# Altium schematic sheet BoardA-PowerSupplies.SchDoc
size A; SheetNumber: 2; SheetTotal: 3
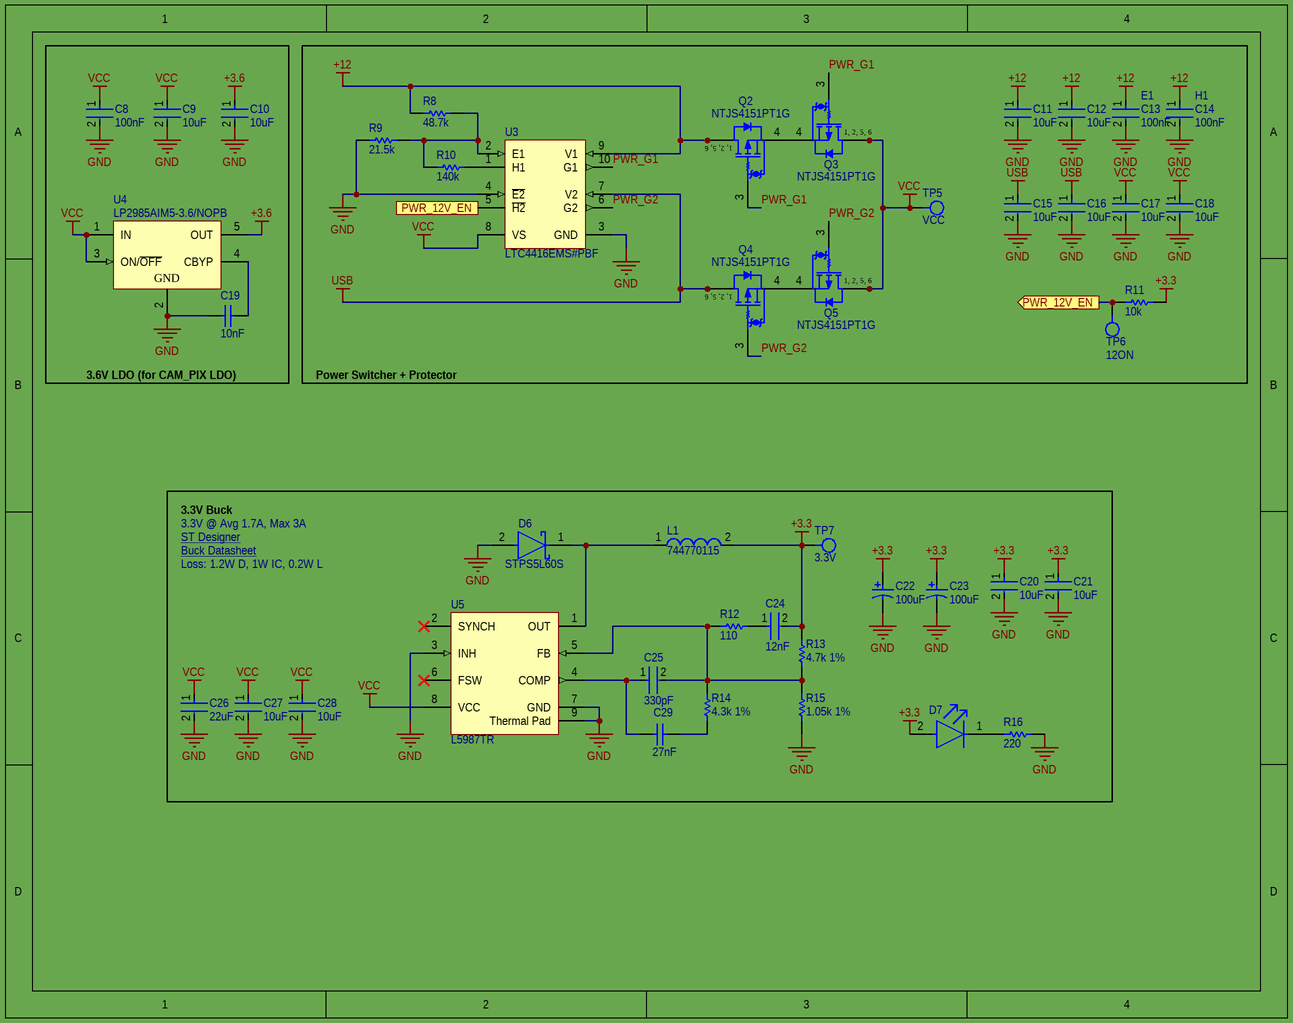
[diagram p0: BoardA-PowerSupplies.SchDoc]

## Parts
C8  100nF  [FP-CGA3E-0_3-0_1-IPC_A]
C9  10uF  [FP-C3225-250-0_4-MFG]
C10  10uF  [FP-C3225-250-0_4-MFG]
C11  10uF  [FP-C3225-250-0_4-MFG]
C12  10uF  [FP-C3225-250-0_4-MFG]
C13  100nF  [FP-CGA3E-0_3-0_1-IPC_A]
C14  100nF  [FP-CGA3E-0_3-0_1-IPC_A]
C15  10uF  [FP-C3225-250-0_4-MFG]
C16  10uF  [FP-C3225-250-0_4-MFG]
C17  10uF  [FP-C3225-250-0_4-MFG]
C18  10uF  [FP-C3225-250-0_4-MFG]
C19  10nF  [CAPC1608X90X35ML10T15]
C20  10uF  [FP-C3225-250-0_4-MFG]
C21  10uF  [FP-C3225-250-0_4-MFG]
C22  100uF  [CAPMP6032X28-T_V]
C23  100uF  [CAPMP6032X28-T_V]
C24  12nF  [FP-C0603C-CF-MFG]
C25  330pF  [FP-CC0603-DA-MFG]
C26  22uF  [FP-C4532-250-0_4-IPC_B]
C27  10uF  [FP-C3225-250-0_4-MFG]
C28  10uF  [FP-C3225-250-0_4-MFG]
C29  27nF  [CAPC1608X90X35NL10T15]
D6  STPS5L60S  [FP-STPS5L60S-MFG]
D7  SML-D12U1WT86  [FP-SML-D12-MFG]  (value not drawn)
L1  744770115  [WE-PD-XL]
Q2  NTJS4151PT1G  [ONSC-SC70-6-419B-02_W_V]
Q3  NTJS4151PT1G  [ONSC-SC70-6-419B-02_W_V]
Q4  NTJS4151PT1G  [ONSC-SC70-6-419B-02_W_V]
Q5  NTJS4151PT1G  [ONSC-SC70-6-419B-02_W_V]
R8  48.7k  [RESC1608X55X30ML15T15]
R9  21.5k  [RESC1608X55X30ML15T15]
R10  140k  [RESC1608X55X30LL15T15]
R11  10k  [RESC1609X55X30LL15T15]
R12  110  [RESC1608X55X30ML20T20]
R13  4.7k 1%  [RESC1608X55X30NL15T15]
R14  4.3k 1%  [RESC1609X50X30ML10T20]
R15  1.05k 1%  [RESC1608X55X30ML15T15]
R16  220  [RESC1005X40X25LL05T05]
TP5  VCC  [TestPoint1mm]
TP6  12ON  [TestPoint1mm]
TP7  3.3V  [TestPoint1mm]
U3  LTC4416EMS#PBF  [LT-MS-10_N]
U4  LP2985AIM5-3.6/NOPB  [MF05A_M]
U5  L5987TR  [VFQFPN8_M]

## Blocks framed on the sheet
3.6V LDO (for CAM_PIX LDO): C8-C10 C19 U4

## Ports
PWR_12V_EN (out)

## Nets
+3.3: C20.1 C21.1 C22.1 C23.1 C24.2 D7.2(A) L1.2 R11.2 R13.2 TP7.1
+3.6: C10.1 U4.5(OUT)
+12: C11.1 C12.1 C13.1 C14.1 Q2.1(D) Q2.2(D) Q2.5(D) Q2.6(D) R8.1 U3.9(V1)
GND: C8.2 C9.2 C10.2 C11.2 C12.2 C13.2 C14.2 C15.2 C16.2 C17.2 C18.2 C19.2 C20.2 C21.2 C22.2 C23.2 C26.2 C27.2 C28.2 D6.2(A) R9.1 R15.1 R16.2 U3.3(GND) U3.4(~{E2}) U4.2(GND) U5.3(INH) U5.7(GND) U5.9(Thermal_Pad)
USB: C15.1 C16.1 Q4.1(D) Q4.2(D) Q4.5(D) Q4.6(D) U3.7(V2)
VCC: C8.1 C9.1 C17.1 C18.1 C26.1 C27.1 C28.1 Q3.1(D) Q3.2(D) Q3.5(D) Q3.6(D) Q5.1(D) Q5.2(D) Q5.5(D) Q5.6(D) TP5.1 U3.8(VS) U4.1(IN) U4.3(ON/~{OFF}) U5.8(VCC)
PWR_12V_EN: R11.1 TP6.1 U3.5(~{H2}) ; port PWR_12V_EN
PWR_G1: Q2.3(G) Q3.3(G) U3.10(G1)
PWR_G2: Q4.3(G) Q5.3(G) U3.6(G2)
NetC19_1: C19.1 U4.4(CBYP)
NetC24_1: C24.1 R12.2
NetC25_1: C25.1 C29.2 U5.4(COMP)
NetC25_2: C25.2 R12.1 R13.1 R14.2 R15.2 U5.5(FB)
NetC29_1: C29.1 R14.1
NetD6_1: D6.1(C) L1.1 U5.1(OUT)
NetD7_1: D7.1(C) R16.1
NetQ2_4: Q2.4(S) Q3.4(S)
NetQ4_4: Q4.4(S) Q5.4(S)
NetR8_2: R8.2 R9.2 R10.1 U3.2(E1)
NetR10_2: R10.2 U3.1(H1)

Not connected (* = marked no-connect by the designer): U5 2(SYNCH)* 6(FSW)*

## Notes on the sheet
- E1
- (near C14) H1
- Power Switcher + Protector
- 3.3V Buck
- 3.3V @ Avg 1.7A, Max 3A
- ST Designer <https://eds.st.com/dcdc/>
- Buck Datasheet <https://www.mouser.com/datasheet/2/389/cd00208518-1796746.pdf>
- Loss: 1.2W D, 1W IC, 0.2W L
- (in symbol CMP-1058-00631-1) 1, 2, 5, 6

## Library data of the parts
C8 C13 C14 = CMP-2000-07546-2: Cap Ceramic 100nF 50V X7R 10% Pad SMD 0603 +125°C Automotive T/R; Weight: 7.1E-05oz; Composition: Ceramic; Max Operating Temperature: 125°C; Termination: SMD/SMT; Dielectric: X7R; Length: 1.6mm; Package Quantity: 1; REACH SVHC: No SVHC; Lead Free: Lead Free; Case Code (Metric): 1608; Min Operating Temperature: -55°C; Packaging: Tape and Reel; Tolerance: 10%; Voltage Rating: 50V; Case Code (Imperial): 0603; Capacitance: 100nF; Case/Package: 0603; Voltage Rating (DC): 50V; Depth: 0.8mm; Radiation Hardening: No; Ratings: AEC-Q200; Mount: Surface Mount; Voltage: 50V; Thickness: 0.035inch; Width: 0.8mm; Height: 0.8mm
C9-C12 C15-C18 C20 C21 C27 C28 = CMP-08246-002653-1: Multilayer Ceramic Capacitors 10uF ±20% 50V X7R SMD 1210; Width: 0.098inch; Package Quantity: 1000; Height: 2.5mm; Dielectric Material: Ceramic; Voltage Rating: 50V; Series: C; Capacitance: 10uF; Tolerance: 20%; Weight: 0.000564oz; Case/Package: 1210; Case Code (Imperial): 1210; Dielectric: X7R; Case Code (Metric): 3225; REACH SVHC: No SVHC; Packaging: Tape and Reel; Length: 0.126inch; Termination: SMD/SMT; Min Operating Temperature: -55°C; Voltage Rating (DC): 50V; Lead Free: Lead Free; Max Operating Temperature: 125°C; Thickness: 0.11inch; Mount: Surface Mount
C19 = CMP-2100-03642-1: Chip Capacitor, 10 nF, +/- 10%, 50 V, -55 to 125 degC, 0603 (1608 Metric), RoHS, Tape and Reel; Manufacturer: Murata; Insulation Resistance: 10GR; Dielectric: X7R; Voltage Rating: 50V; Material: Ceramic; Package Quantity: 1; Lead Free: LeadFree; Case/Package: 0603; Termination: SMD/SMT; REACH SVHC: Unknown; Manufacturer URL: http://www.murata.com/; Datasheet URL: http://search.murata.co.jp/Ceramy/image/img/A01X/G101/ENG/GRM188R71H103KA01-01.pdf; Mount: SurfaceMount; Datasheet Version: 42401.0; Number of Pins: 2; Length: 1.6mm; Voltage: 50V; Depth: 0.8mm; Tolerance: 10%; Min Operating Temperature: -55degC; Voltage Rating (DC): 50V; Max Operating Temperature: 125degC; Package Description: 2-Pin Surface Mount Device, Body 1.6 x 0.8 mm; RoHSCompliant: True; Case Code (Imperial): 0603; Width: 0.031inch; Case Code (Metric): 1608; Height: 0.8mm; Package Reference: 0603; Packaging: TapeandReel; Thickness: 0.035inch; Capacitance: 10nF; Dielectric Material: Ceramic
C22 C23 = CMP-2000-07294-1: Low ESR, 100 uF, 10 V, +/- 10%, -55 to 125 degC, 2-Pin SMD, RoHS, Tape and Reel; Manufacturer: AVX; DELETED: Compliant; Voltage: 10VDC; Rad Hardened: No; Polarity: Polar; Wire Form: NotRequired; Case Style: Molded; Product Length (mm): 6mm; DF: 8%; ESR: 0.1ohm; Product Diameter (mm): NotRequiredmm; Product Height (mm): 2.6mm; DCL: 10uA; Capacitance: 100000000pF; Product Depth (mm): 3.2mm; Tolerance (+ or -): 10%; Mounting Technology: SurfaceMount; Failure Rate: NotRequired; Mounting Style: SurfaceMount; Packaging: TapeandReel; Construction: SMTChip; Datasheet Version: 01/2017; Manufacturer URL: http://www.avx.com/; Case Code: C; Datasheet URL: http://datasheets.avx.com/TPS.pdf; Operating Temp Range: -55Cto125C; Package Description: 2-Pin Surface Mount Device, Body 6 x 3.25 mm; Seated Plane Height: NotRequiredmm; Length W/Weld (max): NotRequiredmm; Package URL: http://www.avx.com/download/software/literature/AVX-Footprint-Library.pdf; Package Reference: CAPMP06032X28-T; Length W/Weld: NotRequiredmm; Insulation: NotRequired; Lead Spacing (nom): NotRequiredmm; Package / Case: 6032-28; Seal: NotRequired
C24 = CMP-2006-02245-2: CAP CER 0.012UF 50V 10% X7R 0603; Manufacturer: KEMET; Manufacturer Part Number: C0603C123K5RACTU; Value: 12,000 pF; Automotive Grade: Grade 1; Material: Ceramic; Tolerance: 0.1; Temperature Coefficient: 30ppm/°C; Category: Cap; Height: 0.87mm; Lead Free: Yes; Temperature: -55°C to +125°C; Device Class L2: Capacitors; RoHS: TRUE; Capacitance: 12,000 pF; Mouser Description: Multilayer Ceramic Capacitors MLCC - SMD/SMT 50volts 12000pF X7R 10%; Temperature Range Low: -55°C; Temperature Range High: +125°C; Temperature Characteristic: X7R; Device Class L1: Passive Components; Package: C0603C-CF; Voltage Rating: 50 V; Octopart: https://octopart.com/c0603c123k5ractu-kemet-9143719; Device Class L3: Ceramic Capacitors; ComponentLink2URL: https://api.kemet.com/component-edge/download/datasheet/C0603C100J5GACAUTO.pdf; Automotive: Yes; ComponentLink2Description: Datasheet; Digikey Description: CAP CER 0.012UF 50V 10% X7R 0603
C25 = CMP-03422-000084-1: CAP CER 330PF 50V X7R 0603; Manufacturer Part Number: CC0603KRX7R9BB331; Manufacturer: YAGEO; Tolerance: 0.1; Temperature Coefficient: 15%; Material: Ceramic; Voltage Rating: 50 V; Temperature Characteristic: X7R; RoHS: TRUE; Height: 0.9mm; Voltage: 50 V; Package: CC0603-DA; Category: Cap; Automotive: No; Temperature Range Low: -55°C; Lead Free: Yes; Device Class L2: Capacitors; Device Class L1: Passive Components; ComponentLink2Description: Datasheet; Value: 330 pF; Capacitance: 330 pF; Temperature: -55°C to +125°C; Temperature Range High: +125°C; Mouser Description: CAP CER 330PF 50V X7R 0603; Octopart: https://octopart.com/cc0603krx7r9bb331-yageo-193039; Footprint Url: http://www.yageo.com/exep/pages/download/literatures/UPY-C_GEN_24.pdf; ComponentLink2URL: http://www.yageo.com/documents/recent/UPY-GPHC_X7R_6.3V-to-50V_18.pdf; Digikey Description: CAP CER 330PF 50V X7R 0603; Device Class L3: Ceramic Capacitors
C26 = CMP-08246-004073-1: Multilayer Ceramic Capacitors 22uF ±20% 25V X5R SMD 1812; Weight: 0.000952oz; RoHS Compliant: Yes; Construction: Flat; Max Operating Temperature: 85°C; Case Code (Metric): 4532; REACH SVHC: No SVHC; Tolerance: 20%; Number of Pins: 2; Package Quantity: 1; Mount: Surface Mount; Min Operating Temperature: -55°C; Voltage Rating (DC): 25V; Radiation Hardening: No; Capacitance: 22uF; Width: 0.126inch; Case/Package: 1812; Dielectric: X5R; Voltage Rating: 25V; Height: 2.5mm; Length: 4.5mm; Lead Free: Lead Free; Thickness: 0.11inch; Depth: 3.2mm; Voltage: 25V; Dielectric Material: Ceramic; Termination: SMD/SMT; Packaging: Tape and Reel; Case Code (Imperial): 1812; Resistor Type: Ceramic; Series: C
C29 = CMP-2006-02878-1: Part Number: GRM188R71E273KA01D; Manufacturer: Murata
D6 = CMP-12187-000009-2: DIODE SCHOTTKY 60V 5A SMC; Max Forward Surge Current (Ifsm): 150A; Max Reverse Leakage Current: 220uA; Forward Voltage: 520mV; Element Configuration: Single; Radiation Hardening: No; Package Quantity: 2500; REACH SVHC: No SVHC; Max Reverse Voltage (DC): 60V; Number of Pins: 2; Mount: Surface Mount; Height: 2.45mm; Forward Current: 5A; Packaging: Tape and Reel; Width: 6.25mm; Series: -; Peak Non-Repetitive Surge Current: 150A; Average Rectified Current: 5A; Max Surge Current: 150A; Case/Package: SMC; Lead Free: Lead Free; Max Repetitive Reverse Voltage (Vrrm): 60V; Min Operating Temperature: -65°C; RoHS Compliant: Yes; Length: 7.15mm; Max Reverse Current: 220uA; Max Operating Temperature: 150°C
D7 = CMP-08952-000009-1: LED RED DIFFUSED 1608 SMD; Manufacturer: Rohm; Led Orientation: Top View; Power Dissipation: 54mW; Forward Current: 20mA; Wavelength: 620nm; Reverse Voltage: 5V; Luminous Intensity: 63mcd; Forward Voltage: 2.2V; Mouser Description: SML-D12 Series Red 0603 Diffused 63 mcd 2.2 V Surface Mount LED; Temperature: -40°C to +85°C; Device Class L2: LEDs; Lead Free: Yes; Automotive: No; Octopart: https://octopart.com/sml-d12u1wt86-rohm-70850259; RoHS: TRUE; Colour: Red; Digikey Description: LED RED DIFFUSED 1608 SMD; Package: SML-D12; Device Class L1: Optoelectronics; Category: Diode; Temperature Range High: +85°C; Height: 0.65mm; ComponentLink2Description: Datasheet; Temperature Range Low: -40°C; ComponentLink2URL: https://www.rohm.com/datasheet/SML-D12U1W/sml-d12x1-e; Manufacturer Part Number: SML-D12U1WT86; Device Class L3: unset
L1 = CMP-0227-00202-1: SMD-Shielded Power Inductor WE-PD, L = 15.0 µH; Inductance: 15.0 ÂµH; PackageDescription: SMD Inductor, 2-Leads, Body 12.0 x 12.0 mm; ComponentLink2Description: Datasheet; PackageReference: WE-PD-XL; ComponentLink1URL: http://www.we-online.com; ComponentLink1Description: Manufacturer Link; DatasheetVersion: ver 5, Oct-2004; PackageVersion: 2004; ComponentLink2URL: http://www.we-online.de/katalog/media/pdf/744770115.pdf
Q2-Q5 = CMP-1058-00631-1: Trench Power MOSFET, -20 V, -4.2 A, Single P-Channel, 6-Pin SC70, Pb-Free, Tape and Reel; Manufacturer: On Semiconductor; VGS(th) Max (V): 1.2; VGS Max (V): 12; Crss Typ (pF): 110; Ciss Typ (pF): 850; PD Max (W): 1; Qrr Typ (nC): 0.23; ID Max (A): 4.2; Coss Typ (pF): 160; Channel Polarity: P Channel; V(BR)DSS Min (V): 20; Mounting Technology: Surface Mount; ComponentLink3Description: Package Specification; Packing: Tape and Reel; DatasheetVersion: Rev. 1; RoHS: Pb-Free; Configuration: Single; PackageReference: SC70-6-419B-02_W; PackageVersion: Rev. W; Package Type: SC-88-6 / SC-70-6 / SOT-363-6; ComponentLink3URL: http://www.onsemi.com/pub_link/Collateral/SMF05C-D.PDF; PackageDescription: 6-Pin Small Outline Transistor, Body 2 x 1.25 mm, Pitch 0.65 mm; PartNumber: NTJS4151PT1G; ComponentLink2Description: Datasheet; ComponentLink1Description: Manufacturer URL; ComponentLink2URL: http://www.onsemi.com/pub_link/Collateral/NTJS4151P-D.PDF; ComponentLink1URL: http://www.onsemi.com/
R8 = CMP-1012-00701-2: Manufacturer: Panasonic; Part Number: ERJ-3EKF4872V
R9 = CMP-2000-00332-1: Part Number: ERJ-3EKF2152V; Manufacturer: Panasonic
R10 = CMP-2000-00248-1: Manufacturer: Panasonic; Part Number: ERJ-3EKF1403V
R11 = CMP-1012-00623-3: Chip Resistor, 10 KOhm, +/- 1%, 0.1 W, -55 to 155 degC, 0603 (1608 Metric), RoHS, Tape and Reel; Manufacturer: Panasonic; Voltage Rating: 75V; Case\/Package: 0603; Power Rating: 100mW; Resistance: 10KOhm; Temperature Coefficient: 100ppm\/degreesC; Number of Pins: 2; Package Reference: 603; Depth: 0.8mm; Mount: SurfaceMount; Package Description: 2-Pin Surface Mount Device, Body 1.6 x 0.85 mm; Datasheet Version: 02/2017; Length: 1.6mm; Lead Free: LeadFree; Height: 0.45mm; Number of Terminations: 2; Max Power Dissipation: 100mW; Min Operating Temperature: -55degC; Datasheet URL: https://industrial.panasonic.com/cdbs/www-data/pdf/RDA0000/AOA0000C304.pdf; Termination: SMD/SMT; Case Code (Metric): 1608; Case Code (Imperial): 0603; Tolerance: 1%; Max Operating Temperature: 155degC; RoHSCompliant: true; Voltage Rating (DC): 75V; Radiation Hardening: No; Packaging: TapeandReel; Composition: ThickFilm; Mounting Technology: SurfaceMount; Manufacturer URL: http://www.panasonic.com/; Width: 0.031inch; REACH SVHC: NoSVHC; Contact Plating: Tin; Military Standard: Not; Package Quantity: 1
R12 = CMP-2000-00881-1: Part Number: ERA-3AEB111V; Manufacturer: Panasonic
R13 = CMP-1012-00586-3: Precision Thick Film Chip Resistor, 4.7 KOhm, +/- 1%, -55 to 155 degC, 0603 (1608 Metric), RoHS, Tape and Reel; Resistance: 220 Ohm; Voltage Rating: 50 V; Elements: 4; Case\Package: 1205; Tolerance: 5%; Power Rating: 250 mW; PackageReference: 0603; Max Operating Temperature: 125 degC; REACH SVHC: No SVHC; Width: 0.063 inch; Length: 0.126 inch; Height: 0.024 inch; Mount: Surface Mount; Package Quantity: 1; DatasheetVersion: Apr-15; ComponentLink1Description: Manufacturer URL; Min Operating Temperature: -55 degC; Packaging: Tape and Reel; Radiation Hardening: No; ComponentLink2URL: http://industrial.panasonic.com/cdbs/www-data/pdf/RDA0000/AOA0000C86.pdf; Case Code (Metric): 3216; Pins: 8; Case Code (Imperial): 1206; Type (Resistor): Thick Film; RoHSCompliant: true; ComponentLink2Description: Datasheet; PackageDescription: 2-Pin Surface Mount Device, Body 1.6 x 0.85 mm; ComponentLink1URL: http://www.panasonic.com/
R14 = CMP-2000-03405-1: Manufacturer: Vishay Dale; Part Number: CRCW06034K30FKEA
R15 = CMP-2000-00188-1: Part Number: ERJ-3EKF1051V; Manufacturer: Panasonic
R16 = CMP-2002-00487-3: Chip Resistor, 220 Ohm, +/- 5%, 100 mW, -55 to 155 degC, 0402 (1005 Metric), RoHS, Tape and Reel; Manufacturer: Basic Passives; PartNumber: ERJ-2GEJ221X; Voltage Rating: 50 V; Case\/Package: 0402; Power Rating: 100 mW; Resistance: 220 Ohm; Mounting Technology: Surface Mount; Width: 0.5 mm; Package Quantity: 10000; REACH SVHC: Unknown; Height: 0.35 mm; PackageReference: 0402; PackageDescription: 2-Pin Surface Mount Device, Body 1 x 0.5 mm; Length: 1 mm; Max Operating Temperature: 155 degC; Tolerance: 5%; ComponentLink1Description: Manufacturer URL; Pins: 2; ComponentLink1URL: http://www.panasonic.com/; Min Operating Temperature: -55 degC; Case Code (Imperial): 0402; Mount: Surface Mount; Case Code (Metric): 1005; ComponentLink2URL: http://industrial.panasonic.com/cdbs/www-data/pdf/RDA0000/AOA0000C84.pdf; Packaging: Tape and Reel; ComponentLink2Description: Datasheet; DatasheetVersion: 04/2015; Radiation Hardening: No; RoHSCompliant: true
TP5-TP7 = TestPoint1mm: Test Point 1mm Diameter
U3 = CMP-0479-00144-1: Low Loss Dual PowerPath Controller for Large PFET, 3.6 to 36 V Vin, 10-pin SOP (MS-10), -40 to 85 degC, Pb-Free; Manufacturer: Linear Technology; Ideal Diode: Dual, External, P-Channel; ComponentLink2Description: Datasheet; ComponentLink1URL: http://www.linear.com/; ComponentLink2URL: http://cds.linear.com/docs/en/datasheet/4416fa.pdf; ComponentLink3Description: Package Specification; PackageReference: MS-10; RoHS: TRUE; PackageDescription: 10-Pin Plastic MSOP, Body 3 x 3 mm, Pitch 0.5 mm; ComponentLink3URL: http://cds.linear.com/docs/en/packaging/05081661_F_MS.pdf; PackageVersion: Rev. E, 06/2010; PartNumber: LTC4416EMS#PBF; ComponentLink1Description: Manufacturer URL; DatasheetVersion: Rev. A; Mounting Technology: Surface Mount
U4 = CMP-0062-02036-2: Micropower 150 mA Low-Noise Ultra Low-Dropout Regulator, 5-pin SOT-23, Pb-Free; Manufacturer: National Semiconductor; CompType: LDO IC; PackageTopMarking: L0SA*XTT; PowerWise: N; RoHS: Y; DatasheetVersion: Jul-2007; ComponentLink2Description: LP2985 Web Page; ComponentLink1Description: LP2985 Datasheet; ComponentLink3Description: MF05A Package Page; PackageVersion: revD, Aug-2008; ComponentLink2URL: http://www.national.com/pf/LP/LP2985.html; PinCount: 5; ComponentLink3URL: http://www.national.com/packaging/folders/mf05a.html; RevisionNote: Component URLs added; ComponentLink1URL: http://www.national.com/ds/LP/LP2985.pdf; PackageDescription: Molded SOT-23, .115 x .063 x .040 in Body, 5 Lead, .0375 in Pitch; PackageReference: MF05A
U5 = CMP-0240-00148-1: Up to 3 A step down switching regulator, 8-Pin VFQFPN, Tape and Reel; PackageReference: VFQFPN8; ComponentLink1Description: Manufacturer URL; PackageVersion: 2009; ComponentLink2Description: Datasheet; ComponentLink1URL: http://www.st.com; ComponentLink2URL: http://www.st.com/internet/com/TECHNICAL_RESOURCES/TECHNICAL_LITERATURE/DATASHEET/CD00208518.pdf; DatasheetVersion: Jun-2009; PackageDescription: 8-Pin VFQFPN, 3 x 3 x 1.08 mm Body, 0.5 mm Pitch, Exposed Pad